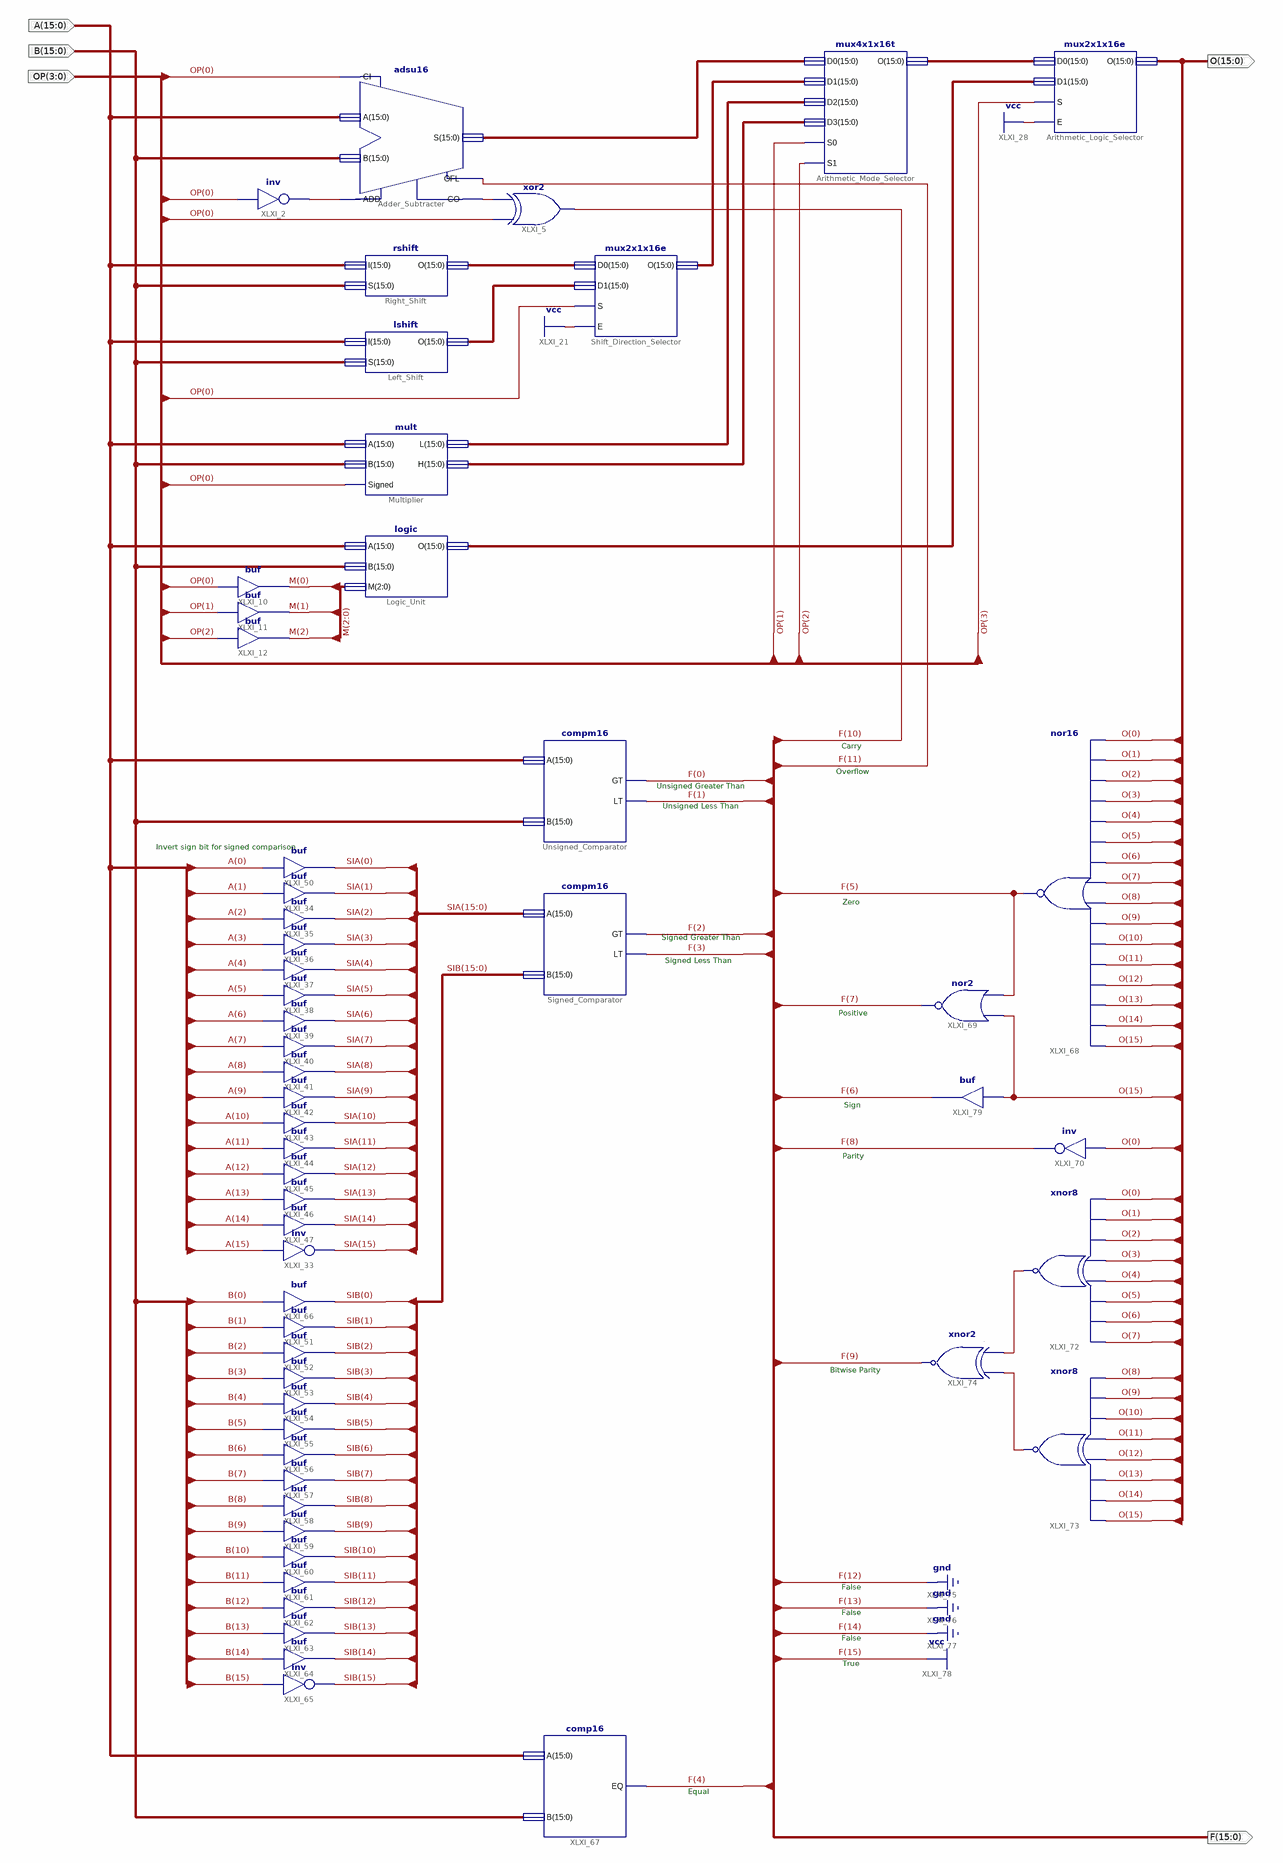
[diagram p0: schematic sheet 1]
// Xilinx ISE schematic alu.sch (spartan6) as structural Verilog: 55 symbols, 5 ports
module alu (
  input  [15:0] A,
  input  [15:0] B,
  input  [3:0] OP,
  output [15:0] O,
  output [15:0] F
);

  wire XLXN_13, XLXN_19, XLXN_169, XLXN_170;
  wire [2:0] M;
  wire [15:0] SIA, SIB, XLXN_37, XLXN_38, XLXN_53, XLXN_54, XLXN_55, XLXN_56, XLXN_57, XLXN_58;

  adsu16 Adder_Subtracter (.A(A), .ADD(XLXN_13), .B(B), .CI(OP[0]), .CO(XLXN_19), .OFL(F[11]), .S(XLXN_55));
  not XLXI_2 (XLXN_13, OP[0]);
  xor XLXI_5 (F[10], OP[0], XLXN_19);
  lshift Left_Shift (.I(A), .O(XLXN_38), .S(B));
  rshift Right_Shift (.I(A), .O(XLXN_37), .S(B));
  mult Multiplier (.A(A), .B(B), .H(XLXN_58), .L(XLXN_57), .Signed(OP[0]));
  mux2x1x16e Shift_Direction_Selector (.D0(XLXN_37), .D1(XLXN_38), .E(1'b1), .O(XLXN_56), .S(OP[0]));
  \logic  Logic_Unit (.A(A), .B(B), .M(M), .O(XLXN_53));
  buf XLXI_11 (M[1], OP[1]);
  buf XLXI_12 (M[2], OP[2]);
  buf XLXI_10 (M[0], OP[0]);
  mux2x1x16e Arithmetic_Logic_Selector (.D0(XLXN_54), .D1(XLXN_53), .E(1'b1), .O(O), .S(OP[3]));
  mux4x1x16t Arithmetic_Mode_Selector (
    .D0(XLXN_55), .D1(XLXN_56), .D2(XLXN_57), .D3(XLXN_58), .O(XLXN_54), .S0(OP[1]), .S1(OP[2]));
  compm16 Unsigned_Comparator (.A(A), .B(B), .GT(F[0]), .LT(F[1]));
  compm16 Signed_Comparator (.A(SIA), .B(SIB), .GT(F[2]), .LT(F[3]));
  buf XLXI_34 (SIA[1], A[1]);
  buf XLXI_35 (SIA[2], A[2]);
  buf XLXI_36 (SIA[3], A[3]);
  buf XLXI_37 (SIA[4], A[4]);
  buf XLXI_38 (SIA[5], A[5]);
  buf XLXI_39 (SIA[6], A[6]);
  buf XLXI_40 (SIA[7], A[7]);
  buf XLXI_41 (SIA[8], A[8]);
  buf XLXI_42 (SIA[9], A[9]);
  buf XLXI_43 (SIA[10], A[10]);
  buf XLXI_44 (SIA[11], A[11]);
  buf XLXI_45 (SIA[12], A[12]);
  buf XLXI_46 (SIA[13], A[13]);
  buf XLXI_47 (SIA[14], A[14]);
  not XLXI_33 (SIA[15], A[15]);
  buf XLXI_50 (SIA[0], A[0]);
  buf XLXI_51 (SIB[1], B[1]);
  buf XLXI_52 (SIB[2], B[2]);
  buf XLXI_53 (SIB[3], B[3]);
  buf XLXI_54 (SIB[4], B[4]);
  buf XLXI_55 (SIB[5], B[5]);
  buf XLXI_56 (SIB[6], B[6]);
  buf XLXI_57 (SIB[7], B[7]);
  buf XLXI_58 (SIB[8], B[8]);
  buf XLXI_59 (SIB[9], B[9]);
  buf XLXI_60 (SIB[10], B[10]);
  buf XLXI_61 (SIB[11], B[11]);
  buf XLXI_62 (SIB[12], B[12]);
  buf XLXI_63 (SIB[13], B[13]);
  buf XLXI_64 (SIB[14], B[14]);
  not XLXI_65 (SIB[15], B[15]);
  buf XLXI_66 (SIB[0], B[0]);
  comp16 XLXI_67 (.A(A), .B(B), .EQ(F[4]));
  nor XLXI_68 (F[5], O[0], O[1], O[2], O[3], O[4], O[5], O[6], O[7], O[8], O[9], O[10], O[11], O[12], O[13], O[14], O[15]);
  nor XLXI_69 (F[7], F[5], O[15]);
  not XLXI_70 (F[8], O[0]);
  xnor XLXI_72 (XLXN_169, O[0], O[1], O[2], O[3], O[4], O[5], O[6], O[7]);
  xnor XLXI_73 (XLXN_170, O[8], O[9], O[10], O[11], O[12], O[13], O[14], O[15]);
  xnor XLXI_74 (F[9], XLXN_169, XLXN_170);
  buf XLXI_79 (F[6], O[15]);

  assign F[15:12] = 4'b1000;

  // Notes on the sheet:
  //   Carry
  //   Overflow
  //   Unsigned Greater Than
  //   Unsigned Less Than
  //   Invert sign bit for signed comparison
  //   Zero
  //   Signed Greater Than
  //   Signed Less Than
  //   Positive
  //   Sign
  //   Parity
  //   Bitwise Parity
  //   False
  //   False
  //   False
  //   True
  //   Equal
endmodule
